# Altium schematic sheet TopSheet.SchDoc: TopSheet
size A3; Author: Leah Forrest; CompanyName: Cornell SSDS; Organization: Cornell OAAN
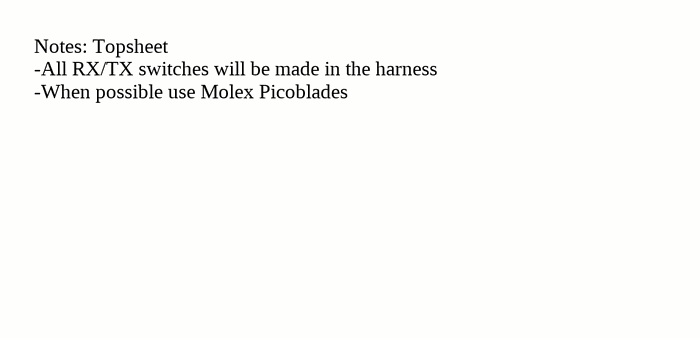
[diagram p0: TopSheet.SchDoc]

## Notes on the sheet
- Notes: Topsheet
  -All RX/TX switches will be made in the harness
  -When possible use Molex Picoblades
- Title
- Size:
- Date:
- A3
- Number:
- Time:
- Revision:
- Sheet
- of
- File: